# Altium schematic sheet LED BAO.SchDoc
size A
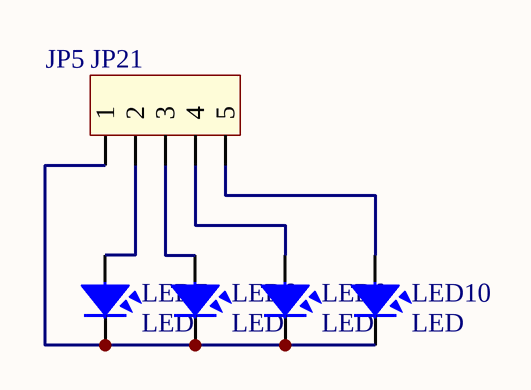
[diagram p0: LED BAO.SchDoc]

## Parts
JP21  JP5  [CON5]
LED7  LED  [LED-3]
LED8  LED  [LED-3]
LED9  LED  [LED-3]
LED10  LED  [LED-3]

## Nets
NetJP21_1: JP21.1 LED7.2 LED8.2 LED9.2 LED10.2
NetJP21_2: JP21.2 LED7.1
NetJP21_3: JP21.3 LED8.1
NetJP21_4: JP21.4 LED9.1
NetJP21_5: JP21.5 LED10.1

## Library data of the parts
JP21 = Con5: Connector 5; Value: Connector 5
LED7-LED10 = LED: LED Single colour Green and Red; Value: LED 3 ly Single Colour; Description: LED 5 ly Single Colour; Description: Led  Vuong